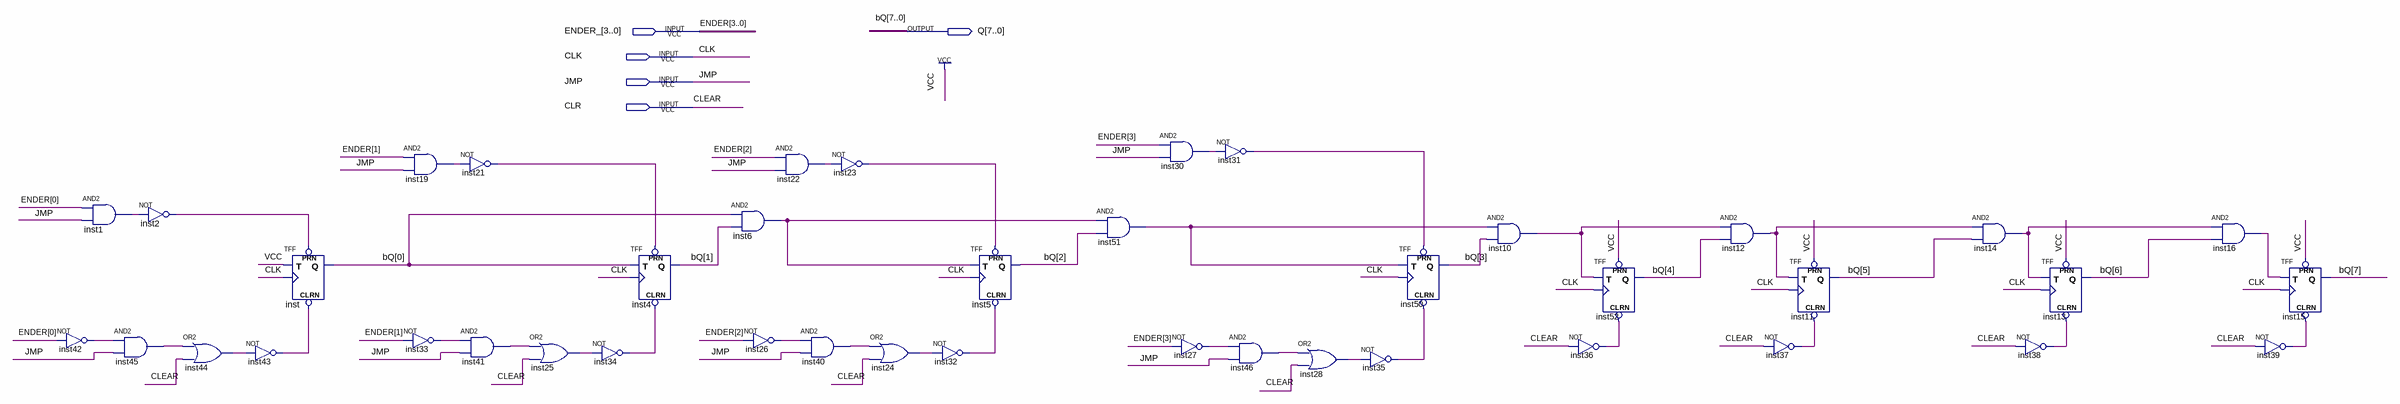
[diagram p0: schematic sheet]
// Quartus schematic Contador.bdf as structural Verilog: 42 symbols, 5 pins
module Contador (
  input  [3:0] ENDER_,
  input  CLK,
  input  JMP,
  input  CLR,
  output [7:0] Q
);

  wire inst1_out, inst2_out, inst6_out, inst10_out, inst12_out, inst14_out, inst16_out, inst19_out,
       inst21_out, inst22_out, inst23_out, inst24_out, inst25_out, inst26_out, inst27_out, inst28_out,
       inst30_out, inst31_out, inst32_out, inst33_out, inst34_out, inst35_out, inst36_out, inst37_out,
       inst38_out, inst39_out, inst40_out, inst41_out, inst42_out, inst43_out, inst44_out, inst45_out,
       inst46_out, inst51_out;

  not inst42 (inst42_out, ENDER_[0]);
  and inst1 (inst1_out, ENDER_[0], JMP);
  and inst45 (inst45_out, inst42_out, JMP);
  not inst2 (inst2_out, inst1_out);
  or inst44 (inst44_out, inst45_out, CLR);
  not inst43 (inst43_out, inst44_out);
  TFF inst (.PRN(inst2_out), .CLRN(inst43_out), .T(1'b1), .CLK(CLK), .Q(Q[0]));
  and inst19 (inst19_out, ENDER_[1], JMP);
  not inst33 (inst33_out, ENDER_[1]);
  not inst21 (inst21_out, inst19_out);
  and inst41 (inst41_out, inst33_out, JMP);
  or inst25 (inst25_out, inst41_out, CLR);
  not inst34 (inst34_out, inst25_out);
  TFF inst4 (.PRN(inst21_out), .CLRN(inst34_out), .T(Q[0]), .CLK(CLK), .Q(Q[1]));
  and inst22 (inst22_out, ENDER_[2], JMP);
  and inst6 (inst6_out, Q[0], Q[1]);
  not inst26 (inst26_out, ENDER_[2]);
  and inst40 (inst40_out, inst26_out, JMP);
  not inst23 (inst23_out, inst22_out);
  or inst24 (inst24_out, inst40_out, CLR);
  TFF inst5 (.PRN(inst23_out), .CLRN(inst32_out), .T(inst6_out), .CLK(CLK), .Q(Q[2]));
  not inst32 (inst32_out, inst24_out);
  and inst51 (inst51_out, inst6_out, Q[2]);
  and inst30 (inst30_out, ENDER_[3], JMP);
  not inst27 (inst27_out, ENDER_[3]);
  not inst31 (inst31_out, inst30_out);
  and inst46 (inst46_out, inst27_out, JMP);
  or inst28 (inst28_out, inst46_out, CLR);
  not inst35 (inst35_out, inst28_out);
  TFF inst50 (.PRN(inst31_out), .CLRN(inst35_out), .T(inst51_out), .CLK(CLK), .Q(Q[3]));
  and inst10 (inst10_out, inst51_out, Q[3]);
  not inst36 (inst36_out, CLR);
  TFF inst52 (.PRN(1'b1), .CLRN(inst36_out), .T(inst10_out), .CLK(CLK), .Q(Q[4]));
  and inst12 (inst12_out, inst10_out, Q[4]);
  not inst37 (inst37_out, CLR);
  TFF inst11 (.PRN(1'b1), .CLRN(inst37_out), .T(inst12_out), .CLK(CLK), .Q(Q[5]));
  and inst14 (inst14_out, inst12_out, Q[5]);
  not inst38 (inst38_out, CLR);
  TFF inst13 (.PRN(1'b1), .CLRN(inst38_out), .T(inst14_out), .CLK(CLK), .Q(Q[6]));
  and inst16 (inst16_out, inst14_out, Q[6]);
  TFF inst15 (.PRN(1'b1), .CLRN(inst39_out), .T(inst16_out), .CLK(CLK), .Q(Q[7]));
  not inst39 (inst39_out, CLR);

  // Other names for the same wires on the sheet: bQ[7:0] = Q; CLEAR = CLR; ENDER[3:0] = ENDER_
endmodule
